# Altium project PCB_DYBoard_Collector_V1.PrjPcb
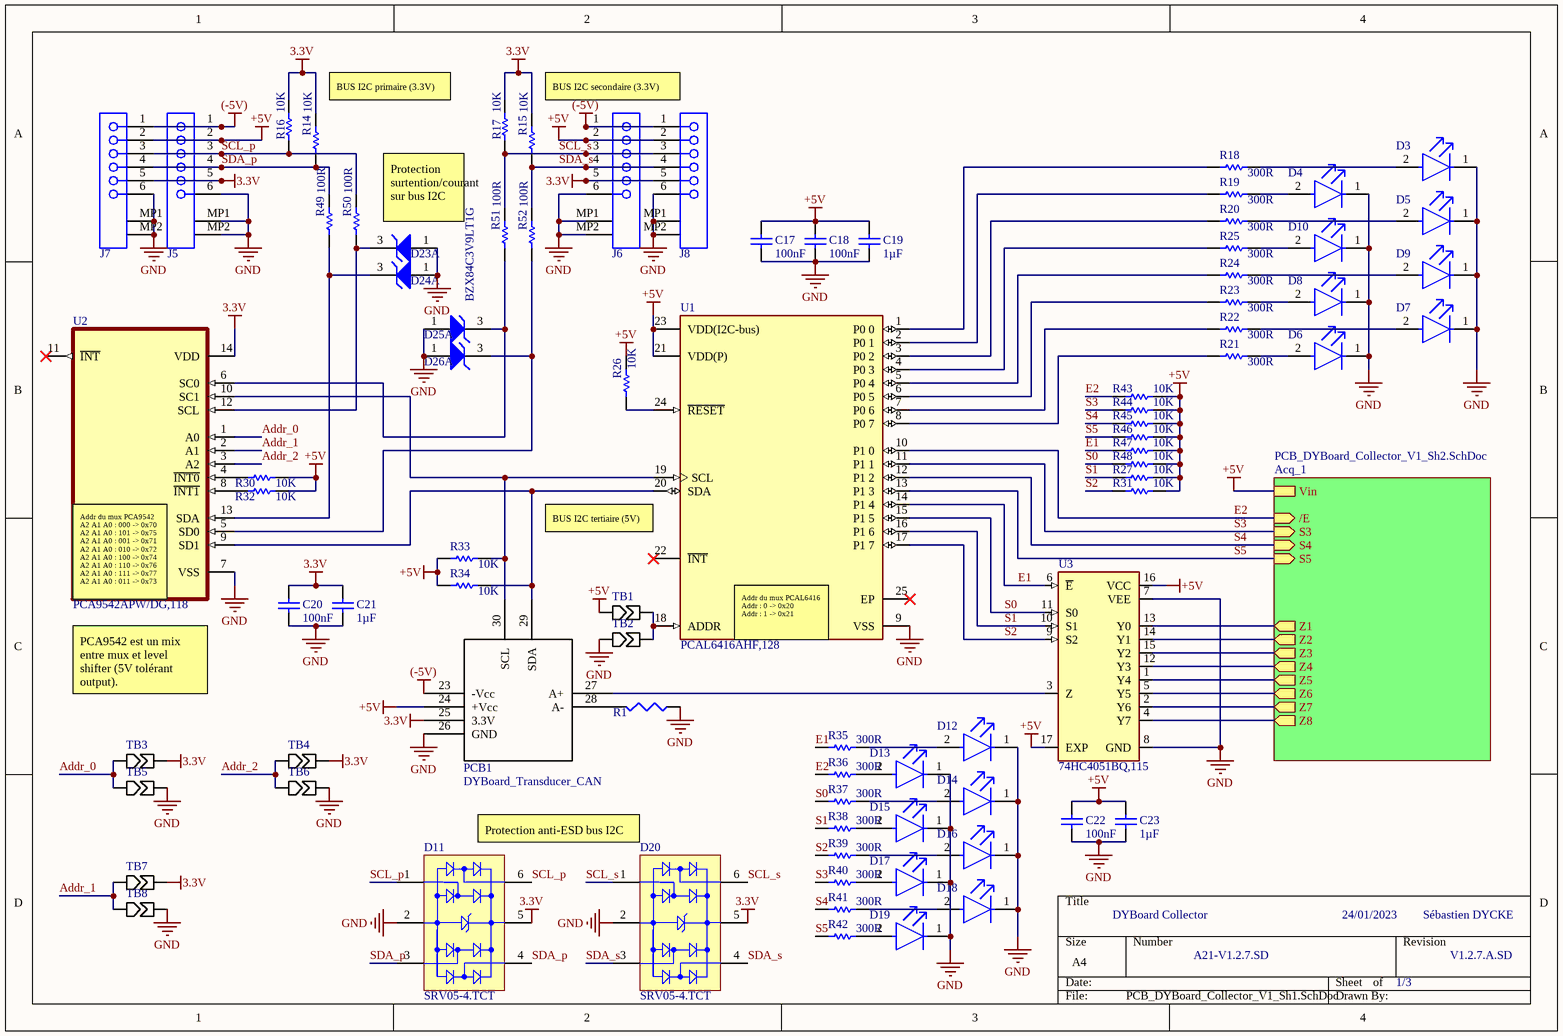
[diagram p0: PCB_DYBoard_Collector_V1_Sh1.SchDoc]
3 sheets, 309 parts. Net scope: hierarchical (ports join the sheet entries above them; power ports are global).
Board file: PCB_DYBoard_Collector_V1.PcbDoc
Sheets:
  PCB_DYBoard_Collector_V1_Sh1.SchDoc
    Acq_1 = PCB_DYBoard_Collector_V1_Sh2.SchDoc
      con_1 = PCB_DYBoard_Collector_V1_Sh3.SchDoc
      con_2 = PCB_DYBoard_Collector_V1_Sh3.SchDoc
      con_3 = PCB_DYBoard_Collector_V1_Sh3.SchDoc
      con_4 = PCB_DYBoard_Collector_V1_Sh3.SchDoc
      con_5 = PCB_DYBoard_Collector_V1_Sh3.SchDoc
      con_6 = PCB_DYBoard_Collector_V1_Sh3.SchDoc
      con_7 = PCB_DYBoard_Collector_V1_Sh3.SchDoc
      con_8 = PCB_DYBoard_Collector_V1_Sh3.SchDoc

## Sheet PCB_DYBoard_Collector_V1_Sh1.SchDoc
size A4; SheetNumber: 1; SheetTotal: 3

### Parts
C17  value 100nF  [1608[0603]]  (hidden comment: Cap Semi)
C18  value 100nF  [1608[0603]]  (hidden comment: Cap Semi)
C19  value 1µF  [1608[0603]]  (hidden comment: Cap Semi)
C20  value 100nF  [1608[0603]]  (hidden comment: Cap Semi)
C21  value 1µF  [1608[0603]]  (hidden comment: Cap Semi)
C22  value 100nF  [1608[0603]]  (hidden comment: Cap Semi)
C23  value 1µF  [1608[0603]]  (hidden comment: Cap Semi)
D3  LTST-C191TBKT  [FP-LTST-C191TBKT-MFG]  (value not drawn)
D4  LTST-C191TBKT  [FP-LTST-C191TBKT-MFG]  (value not drawn)
D5  LTST-C191TBKT  [FP-LTST-C191TBKT-MFG]  (value not drawn)
D6  LTST-C191TBKT  [FP-LTST-C191TBKT-MFG]  (value not drawn)
D7  LTST-C191TBKT  [FP-LTST-C191TBKT-MFG]  (value not drawn)
D8  LTST-C191TBKT  [FP-LTST-C191TBKT-MFG]  (value not drawn)
D9  LTST-C191TBKT  [FP-LTST-C191TBKT-MFG]  (value not drawn)
D10  LTST-C191TBKT  [FP-LTST-C191TBKT-MFG]  (value not drawn)
D11  SRV05-4.TCT  [SMTC-SOT23-6_V]
D12  LTST-C191TBKT  [FP-LTST-C191TBKT-MFG]  (value not drawn)
D13  LTST-C191TBKT  [FP-LTST-C191TBKT-MFG]  (value not drawn)
D14  LTST-C191TBKT  [FP-LTST-C191TBKT-MFG]  (value not drawn)
D15  LTST-C191TBKT  [FP-LTST-C191TBKT-MFG]  (value not drawn)
D16  LTST-C191TBKT  [FP-LTST-C191TBKT-MFG]  (value not drawn)
D17  LTST-C191TBKT  [FP-LTST-C191TBKT-MFG]  (value not drawn)
D18  LTST-C191TBKT  [FP-LTST-C191TBKT-MFG]  (value not drawn)
D19  LTST-C191TBKT  [FP-LTST-C191TBKT-MFG]  (value not drawn)
D20  SRV05-4.TCT  [SMTC-SOT23-6_V]
D23  BZX84C3V9LT1G  [ONSC-SOT-23-3-318-08_V]  (part A of 2)
D24  BZX84C3V9LT1G  [ONSC-SOT-23-3-318-08_V]  (value not drawn)  (part A of 2)
D25  BZX84C3V9LT1G  [ONSC-SOT-23-3-318-08_V]  (value not drawn)  (part A of 2)
D26  BZX84C3V9LT1G  [ONSC-SOT-23-3-318-08_V]  (value not drawn)  (part A of 2)
J5  SEB_MOLeX_6p  [SEB_MOLeX_6p]  (value not drawn)
J6  SEB_MOLeX_6p  [SEB_MOLeX_6p]  (value not drawn)
J7  SEB_MOLeX_6p  [SEB_MOLeX_6p]  (value not drawn)
J8  SEB_MOLeX_6p  [SEB_MOLeX_6p]  (value not drawn)
PCB1  DYBoard_Transducer_CAN  [DYBoard_Transducer_CAN]
R1  Res3  [J1-0603]  (value not drawn)
R14  10K  [RESC1609X60X30LL10T20]
R15  10K  [RESC1609X60X30LL10T20]
R16  10K  [RESC1609X60X30LL10T20]
R17  10K  [RESC1609X60X30LL10T20]
R18  300R  [RESC1609X60X30LL10T20]
R19  300R  [RESC1609X60X30LL10T20]
R20  300R  [RESC1609X60X30LL10T20]
R21  300R  [RESC1609X60X30LL10T20]
R22  300R  [RESC1609X60X30LL10T20]
R23  300R  [RESC1609X60X30LL10T20]
R24  300R  [RESC1609X60X30LL10T20]
R25  300R  [RESC1609X60X30LL10T20]
R26  10K  [RESC1609X60X30LL10T20]
R27  10K  [RESC1609X60X30LL10T20]
R30  10K  [RESC1609X60X30LL10T20]
R31  10K  [RESC1609X60X30LL10T20]
R32  10K  [RESC1609X60X30LL10T20]
R33  10K  [RESC1609X60X30LL10T20]
R34  10K  [RESC1609X60X30LL10T20]
R35  300R  [RESC1609X60X30LL10T20]
R36  300R  [RESC1609X60X30LL10T20]
R37  300R  [RESC1609X60X30LL10T20]
R38  300R  [RESC1609X60X30LL10T20]
R39  300R  [RESC1609X60X30LL10T20]
R40  300R  [RESC1609X60X30LL10T20]
R41  300R  [RESC1609X60X30LL10T20]
R42  300R  [RESC1609X60X30LL10T20]
R43  10K  [RESC1609X60X30LL10T20]
R44  10K  [RESC1609X60X30LL10T20]
R45  10K  [RESC1609X60X30LL10T20]
R46  10K  [RESC1609X60X30LL10T20]
R47  10K  [RESC1609X60X30LL10T20]
R48  10K  [RESC1609X60X30LL10T20]
R49  100R  [RESC1609X60X30LL10T20]
R50  100R  [RESC1609X60X30LL10T20]
R51  100R  [RESC1609X60X30LL10T20]
R52  100R  [RESC1609X60X30LL10T20]
TB1  tin_bridge  [tin_bridge]  (value not drawn)
TB2  tin_bridge  [tin_bridge]  (value not drawn)
TB3  tin_bridge  [tin_bridge]  (value not drawn)
TB4  tin_bridge  [tin_bridge]  (value not drawn)
TB5  tin_bridge  [tin_bridge]  (value not drawn)
TB6  tin_bridge  [tin_bridge]  (value not drawn)
TB7  tin_bridge  [tin_bridge]  (value not drawn)
TB8  tin_bridge  [tin_bridge]  (value not drawn)
U1  PCAL6416AHF,128  [FP-SOT994-1-MFG]
U2  PCA9542APW/DG,118  [SOP65P640X110-14N]
U3  74HC4051BQ,115  [QFN50P250X350X100-17N]

### Sub-sheets
Acq_1 = PCB_DYBoard_Collector_V1_Sh2.SchDoc: Vin, Z1 (out), S3 (in), S4 (in), S5 (in), /E (in), Z2 (out), Z3 (out), Z4 (out), Z5 (out), Z6 (out), Z7 (out), Z8 (out)

### Nets
3.3V: C20.2 C21.2 D11.5(VBUS) D20.5(VBUS) J5.5 J6.5 J7.5 J8.5 PCB1.25(3.3V) R14.2 R15.2 R16.2 R17.2 TB3.22 TB4.22 TB7.22 U2.14(VDD)
(-5V): J5.1 J6.1 J7.1 J8.1 PCB1.23(-Vcc)
+5V: C17.2 C18.2 C19.2 C22.2 C23.2 J5.2 J6.2 J7.2 J8.2 PCB1.24(+Vcc) R26.2 R27.1 R30.1 R31.1 R32.1 R33.2 R34.2 R43.1 R44.1 R45.1 R46.1 R47.1 R48.1 TB1.21 U1.21(VDD(P)) U1.23(VDD(I2C-bus)) U3.16(VCC) U3.17(EXP) ; sheet Acq_1/Vin
GND: C17.1 C18.1 C19.1 C20.1 C21.1 C22.1 C23.1 D3.1(C) D4.1(C) D5.1(C) D6.1(C) D7.1(C) D8.1(C) D9.1(C) D10.1(C) D11.2(GND) D12.1(C) D13.1(C) D14.1(C) D15.1(C) D16.1(C) D17.1(C) D18.1(C) D19.1(C) D20.2(GND) D23.1(A) D24.1(A) D25.1(A) D26.1(A) J5.6 J5.MP1 J5.MP2 J6.6 J6.MP1 J6.MP2 J7.6 J7.MP1 J7.MP2 J8.6 J8.MP1 J8.MP2 PCB1.26(GND) R1.2 TB2.21 TB5.22 TB6.22 TB8.22 U1.9(VSS) U2.7(VSS) U3.7(VEE) U3.8(GND)
Addr_0: TB3.21 TB5.21 U2.1(A0)
Addr_1: TB7.21 TB8.21 U2.2(A1)
Addr_2: TB4.21 TB6.21 U2.3(A2)
E1: R35.1 R47.2 U1.14(P1_4) U3.6(~{E})
E2: R36.1 R43.2 U1.10(P1_0) ; sheet Acq_1//E
S0: R37.1 R48.2 U1.15(P1_5) U3.11(S0)
S1: R27.2 R38.1 U1.16(P1_6) U3.10(S1)
S2: R31.2 R39.1 U1.17(P1_7) U3.9(S2)
S3: R40.1 R44.2 U1.11(P1_1) ; sheet Acq_1/S3
S4: R41.1 R45.2 U1.12(P1_2) ; sheet Acq_1/S4
S5: R42.1 R46.2 U1.13(P1_3) ; sheet Acq_1/S5
SCL_p: D11.1(I/O_1) D11.6(I/O_4) J5.3 J7.3 R16.1 R50.2
SCL_s: D20.1(I/O_1) D20.6(I/O_4) J6.3 J8.3 R17.1 R51.2
SDA_p: D11.3(I/O_2) D11.4(I/O_3) J5.4 J7.4 R14.1 R49.2
SDA_s: D20.3(I/O_2) D20.4(I/O_3) J6.4 J8.4 R15.1 R52.2
NetD3_2: D3.2(A) R18.2
NetD4_2: D4.2(A) R19.2
NetD5_2: D5.2(A) R20.2
NetD6_2: D6.2(A) R21.2
NetD7_2: D7.2(A) R22.2
NetD8_2: D8.2(A) R23.2
NetD9_2: D9.2(A) R24.2
NetD10_2: D10.2(A) R25.2
NetD12_2: D12.2(A) R35.2
NetD13_2: D13.2(A) R36.2
NetD14_2: D14.2(A) R37.2
NetD15_2: D15.2(A) R38.2
NetD16_2: D16.2(A) R39.2
NetD17_2: D17.2(A) R40.2
NetD18_2: D18.2(A) R41.2
NetD19_2: D19.2(A) R42.2
NetD23_3: D23.3(K) R50.1 U2.12(SCL)
NetD24_3: D24.3(K) R49.1 U2.13(SDA)
NetD25_3: D25.3(K) R51.1 U2.6(SC0)
NetD26_3: D26.3(K) R52.1 U2.5(SD0)
NetPCB1_27: PCB1.27(A+) U3.3(Z)
NetPCB1_28: PCB1.28(A-) R1.1
NetPCB1_29: PCB1.29(SDA) R34.1 U1.20(SDA) U2.9(SD1)
NetPCB1_30: PCB1.30(SCL) R33.1 U1.19(SCL) U2.10(SC1)
NetR18_1: R18.1 U1.1(P0_0)
NetR19_1: R19.1 U1.2(P0_1)
NetR20_1: R20.1 U1.3(P0_2)
NetR21_1: R21.1 U1.8(P0_7)
NetR22_1: R22.1 U1.7(P0_6)
NetR23_1: R23.1 U1.6(P0_5)
NetR24_1: R24.1 U1.5(P0_4)
NetR25_1: R25.1 U1.4(P0_3)
NetR26_1: R26.1 U1.24(~{RESET})
NetR30_2: R30.2 U2.4(~{INT0})
NetR32_2: R32.2 U2.8(~{INT1})
NetTB1_22: TB1.22 TB2.22 U1.18(ADDR)
NetU3_1: U3.1(Y4) ; sheet Acq_1/Z5
NetU3_2: U3.2(Y6) ; sheet Acq_1/Z7
NetU3_4: U3.4(Y7) ; sheet Acq_1/Z8
NetU3_5: U3.5(Y5) ; sheet Acq_1/Z6
NetU3_12: U3.12(Y3) ; sheet Acq_1/Z4
NetU3_13: U3.13(Y0) ; sheet Acq_1/Z1
NetU3_14: U3.14(Y1) ; sheet Acq_1/Z2
NetU3_15: U3.15(Y2) ; sheet Acq_1/Z3

Not connected (* = marked no-connect by the designer): U1 22(~{INT})* 25(EP)*; U2 11(~{INT})*

### Notes on the sheet
- BUS I2C primaire (3.3V)
- BUS I2C secondaire (3.3V)
- Protection surtention/courant sur bus I2C
- (near U1) BUS I2C tertiaire (5V)
- (near U2) Addr du mux PCA9542  A2 A1 A0 : 000 -> 0x70  A2 A1 A0 : 101 -> 0x75  A2 A1 A0 : 001 -> 0x71  A2 A1 A0 : 010 -> 0x72  A2 A1 A0 : 100 -> 0x74  A2 A1 A0 : 110 -> 0x76  A2 A1 A0 : 111 -> 0x77  A2 A1 A0 : 011 -> 0x73
- (near U1) Addr du mux PCAL6416  Addr : 0 -> 0x20                 Addr : 1 -> 0x21
- PCA9542 est un mix entre mux et level shifter (5V tolérant output).
- Protection anti-ESD bus I2C
- DYBoard Collector
- 24/01/2023
- Sébastien DYCKE
- A21-V1.2.7.SD
- 1/3
- V1.2.7.A.SD

### Library data of the parts
C17-C23 = Cap Semi: Capacitor (Semiconductor SIM Model); Published: 8-Jun-2000; LatestRevisionDate: 29-May-2009; LatestRevisionNote: IPC-7351 Footprint Added.; PackageReference: C1206; Publisher: Altium Limited; PackageDescription: Chip Capacitor
D3-D10 D12-D19 = CMP-22017-000008-1: LED BLUE CLEAR CHIP SMD; Lens Color: Colorless; Dominant Wavelength: 475nm; Forward Current: 20mA; Wavelength: 468nm; Viewing Angle: 130°; Power Dissipation: 76mW; Luminous Intensity: 180mcd; Reverse Voltage: 5V; Number of Elements: 1; Lens Style: Diffused; Forward Voltage: 3.8V; Max Power Dissipation: 75mW; Case Code (Metric): 1608; Packaging: Tape and Reel; Case/Package: 0603; Depth: 1.6mm; Mount: Surface Mount; Lead Free: Lead Free; Min Operating Temperature: -20°C; Lens Transparency: Clear; Illumination Color: Blue; Height: 0.55mm; Test Current: 20mA; Case Code (Imperial): 0603; Max Operating Temperature: 80°C; Number of Pins: 2; Length: 0.8mm; Radiation Hardening: No; Package Quantity: 1; Number of LEDs: 1; Width: 0.8mm; Color: Blue
D11 D20 = CMP-2000-05358-1: RailClamp(R) Low Capacitance TVS Diode Array, 5 pF, 17.5 VC, -55 to 125 degC, 6-Pin SOT23, RoHS, Tape and Reel; Manufacturer: Semtech; Leakage Current (Max): 5uA; Polarity: Uni-Directional; Peak Pulse Power Dissipation: 300W; Clamping Voltage: 17.5V; Number of Elements: 1; Working Voltage: 5V; Test Current (It): 1mA; Configuration: Quad; Reverse Breakdown Voltage: 6V; Suppressor Type: DiodeArrays; Peak Pulse Current: 12A; Product Depth (mm): 1.6mm; Product Height (mm): 1.15mm; Clamping Voltage (Max): 12.5V; Rad Hardened: No; Product Length (mm): 2.9mm; Capacitance Value: 5pF; Mounting: SurfaceMount; Datasheet URL: https://datasheet.ciiva.com/8029/srv05-4-8029973.pdf; Datasheet Version: Jan-08; Packaging: TapeandReel; Package / Case: SOT-23; Operating Temp Range: -55Cto125C; Pin Count: 6; Direction Type: Uni-Directional; Operating Temperature Min Deg. C: -55C; Reverse Stand-off Voltage: 5V; Leakage Current: 5uA; Manufacturer URL: http://www.semtech.com/; Working Voltage (Max): 5V; Package Reference: SOT23-6; Package Description: 6-Pin Small Outline Transistor, Body 2.9 x 1.6 mm, Pitch 0.95 mm; Operating Temperature Max Deg. C: 125C; Operating Temperature Classification: Military; Mounting Style: SurfaceMount
D23-D26 = CMP-1060-01129-1: Zener Voltage Regulator, 225 mW, 3-Pin SOT-23, Pb-Free, Tape and Reel; Manufacturer: On Semiconductor; ComponentLink3URL: http://www.onsemi.cn/pub_link/Collateral/318-08.PDF; PartNumber: BZX84C3V9LT1G; ComponentLink2URL: http://www.onsemi.com/pub_link/Collateral/BZX84C2V4LT1-D.PDF; PackageReference: SOT-23-3-318-08; DatasheetVersion: Rev. 17; ComponentLink3Description: Package Specification; ComponentLink1Description: Manufacturer URL; Packing: Tape and Reel; ComponentLink1URL: http://www.onsemi.com/; RoHS: Pb-Free; PackageVersion: Rev. AP, 11/2009; Mounting Technology: Surface Mount; PackageDescription: 3-Pin Small Outline Transistor, Body 2.92 x 1.3 mm, Pitch 0.95 mm; ComponentLink2Description: Datasheet
R1 = Res3: Resistor; Published: 8-Jun-2000; LatestRevisionDate: 29-May-2009; LatestRevisionNote: IPC-7351 Footprint Added.; PackageReference: J1-0603; Publisher: Altium Limited; PackageDescription: Chip Resistor
R14-R27 R30-R52 = CMP-2000-03671-1: Part Number: RCWE0603R560FKEA; Manufacturer: Vishay Dale
U1 = CMP-10112-000009-1: IC I/O EXPANDER 16BIT 24HWQFN; Manufacturer: NXP Semiconductors; Number Of I/Os: 16; Min Supply Voltage: 1.65V; Frequency: 400kHz; Standoff Height: 0mm; Max Junction Temp: +125°C; Max Supply Voltage: 5.5V; Nominal Supply Current: 1.1mA; Interface: I2C,SMBus; Digikey Description: IC I/O EXPANDER 16BIT 24HWQFN; Device Class L3: I/O Expanders; Automotive: No; Mouser Description: Interface - I/O Expanders 16-bit I2C-busSMBus Low Voltage; Ambient Temperature Range Low: -40°C; Category: IC; ComponentLink2URL: https://www.nxp.com/docs/en/data-sheet/PCAL6416A.pdf; Ambient Temperature Range High: +85°C; Height: 0.8mm; Device Class L1: Integrated Circuits (ICs); Package: SOT994-1; RoHS: TRUE; Temperature Range High: +85°C; Octopart: https://octopart.com/pcal6416ahf%2C128-nxp+semiconductors-24406122; Lead Free: Yes; ComponentLink2Description: Datasheet; Device Class L2: Interface ICs; Temperature Range Low: -40°C; Manufacturer Part Number: PCAL6416AHF,128; Temperature: -40°C to +85°C; Ipc Land Pattern Name: QFN50P400X400X80-24; Footprint Url: https://www.nxp.com/docs/en/package-information/SOT994-1.pdf
U2 = PCA9542APW/DG,118: 2-channel I2C-bus multiplexer and interrupt logic; Package: None; Price: None; Value: *; MP: PCA9542APW/DG,118; Availability: Unavailable
U3 = 74HC4051BQ,115: 1 Circuit IC Switch 8:1 120Ohm 16-DHVQFN _2.5x3.5_; MF: Nexperia USA; Value: *; SnapEDA_Link: https://www.snapeda.com/parts/74HC4051BQ%2C115/Nexperia%20USA%20Inc./view-part/523294/?ref=snap; Availability: Unavailable; MP: 74HC4051BQ,115; Package: DHVQFN-16 NXP Semiconductors; Price: None

## Sheet PCB_DYBoard_Collector_V1_Sh2.SchDoc
size A4; SheetNumber: 2; SheetTotal: 3
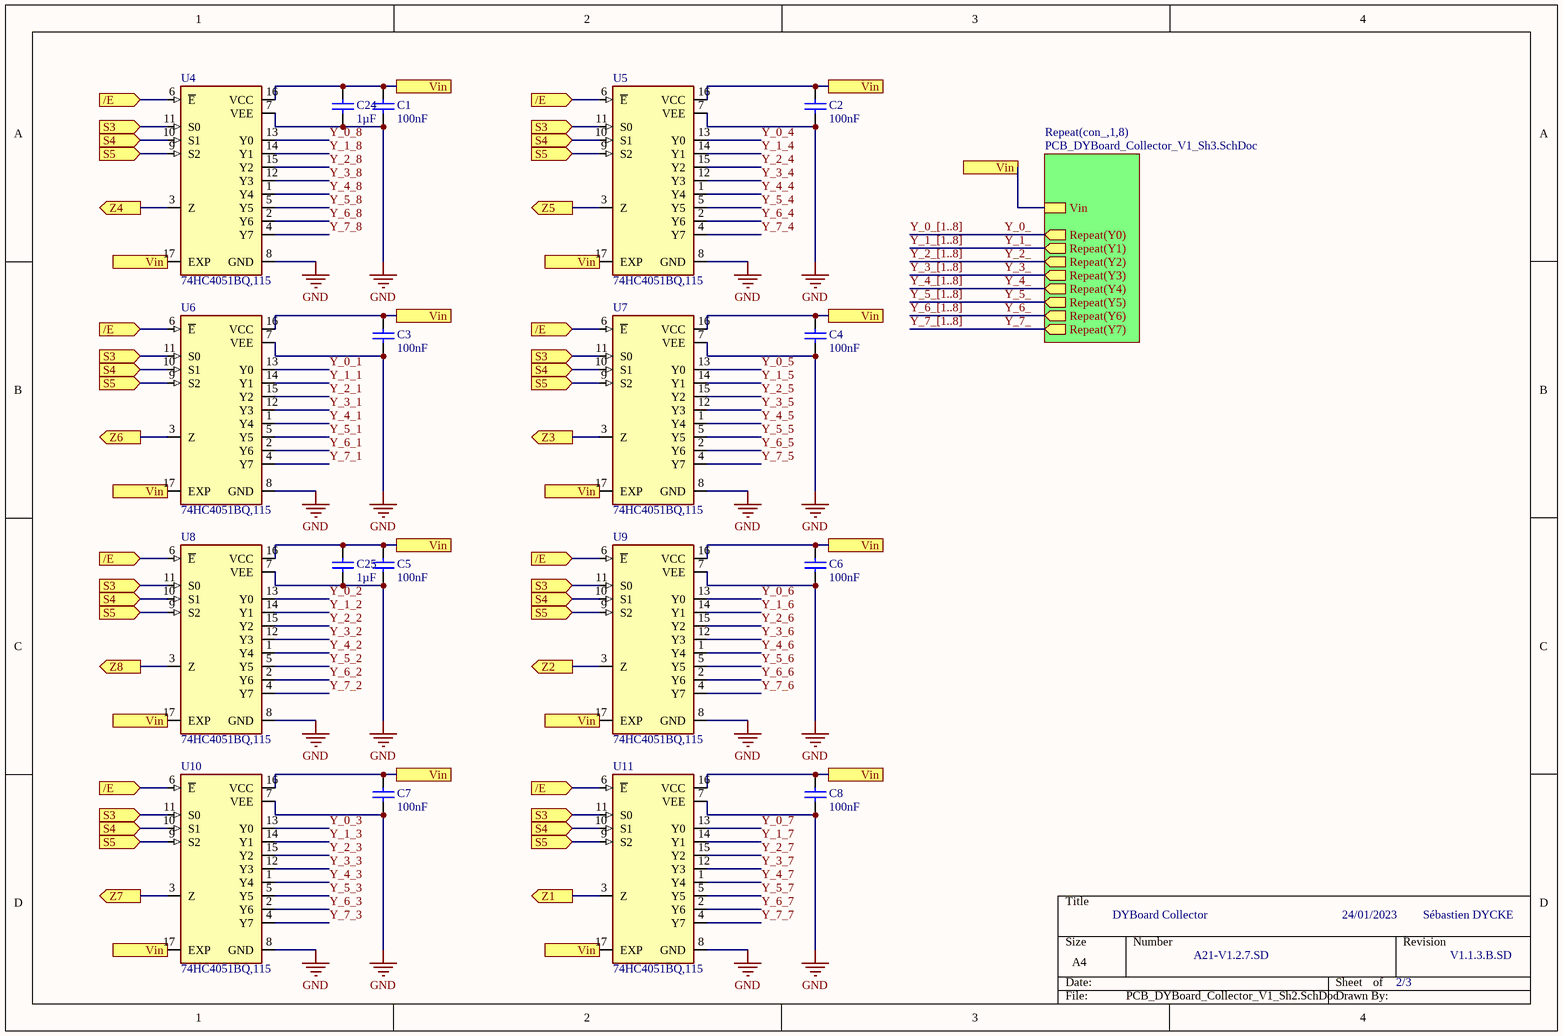
[diagram p1: PCB_DYBoard_Collector_V1_Sh2.SchDoc]

### Parts
C1  value 100nF  [1608[0603]]  (hidden comment: Cap Semi)
C2  value 100nF  [1608[0603]]  (hidden comment: Cap Semi)
C3  value 100nF  [1608[0603]]  (hidden comment: Cap Semi)
C4  value 100nF  [1608[0603]]  (hidden comment: Cap Semi)
C5  value 100nF  [1608[0603]]  (hidden comment: Cap Semi)
C6  value 100nF  [1608[0603]]  (hidden comment: Cap Semi)
C7  value 100nF  [1608[0603]]  (hidden comment: Cap Semi)
C8  value 100nF  [1608[0603]]  (hidden comment: Cap Semi)
C24  value 1µF  [1608[0603]]  (hidden comment: Cap Semi)
C25  value 1µF  [1608[0603]]  (hidden comment: Cap Semi)
U4  74HC4051BQ,115  [QFN50P250X350X100-17N]
U5  74HC4051BQ,115  [QFN50P250X350X100-17N]
U6  74HC4051BQ,115  [QFN50P250X350X100-17N]
U7  74HC4051BQ,115  [QFN50P250X350X100-17N]
U8  74HC4051BQ,115  [QFN50P250X350X100-17N]
U9  74HC4051BQ,115  [QFN50P250X350X100-17N]
U10  74HC4051BQ,115  [QFN50P250X350X100-17N]
U11  74HC4051BQ,115  [QFN50P250X350X100-17N]

### Sub-sheets
Repeat(con_,1,8) = PCB_DYBoard_Collector_V1_Sh3.SchDoc: Vin, Repeat(Y0) (out), Repeat(Y1) (out), Repeat(Y2) (out), Repeat(Y3) (out), Repeat(Y4) (out), Repeat(Y5) (out), Repeat(Y6) (out), Repeat(Y7) (out)

### Ports
/E (in, see PCB_DYBoard_Collector_V1_Sh1[4C]), S3 (in, see PCB_DYBoard_Collector_V1_Sh1[4C]), S4 (in, see PCB_DYBoard_Collector_V1_Sh1[4C]), S5 (in, see PCB_DYBoard_Collector_V1_Sh1[4C]), Vin (see PCB_DYBoard_Collector_V1_Sh1[4B], PCB_DYBoard_Collector_V1_Sh3[1C], PCB_DYBoard_Collector_V1_Sh3[2B], PCB_DYBoard_Collector_V1_Sh3[2C], PCB_DYBoard_Collector_V1_Sh3[3C], PCB_DYBoard_Collector_V1_Sh3[4B], PCB_DYBoard_Collector_V1_Sh3[4C]), Z1 (out, see PCB_DYBoard_Collector_V1_Sh1[4C]), Z2 (out, see PCB_DYBoard_Collector_V1_Sh1[4C]), Z3 (out, see PCB_DYBoard_Collector_V1_Sh1[4C]), Z4 (out, see PCB_DYBoard_Collector_V1_Sh1[4C]), Z5 (out, see PCB_DYBoard_Collector_V1_Sh1[4C]), Z6 (out, see PCB_DYBoard_Collector_V1_Sh1[4C]), Z7 (out, see PCB_DYBoard_Collector_V1_Sh1[4C]), Z8 (out, see PCB_DYBoard_Collector_V1_Sh1[4C])

### Nets
+5V: C1.2 C2.2 C3.2 C4.2 C5.2 C6.2 C7.2 C8.2 C24.2 C25.2 U4.16(VCC) U4.17(EXP) U5.16(VCC) U5.17(EXP) U6.16(VCC) U6.17(EXP) U7.16(VCC) U7.17(EXP) U8.16(VCC) U8.17(EXP) U9.16(VCC) U9.17(EXP) U10.16(VCC) U10.17(EXP) U11.16(VCC) U11.17(EXP) ; port Vin, sheet Repeat(con_,1,8)/Vin
GND: C1.1 C2.1 C3.1 C4.1 C5.1 C6.1 C7.1 C8.1 C24.1 C25.1 U4.7(VEE) U4.8(GND) U5.7(VEE) U5.8(GND) U6.7(VEE) U6.8(GND) U7.7(VEE) U7.8(GND) U8.7(VEE) U8.8(GND) U9.7(VEE) U9.8(GND) U10.7(VEE) U10.8(GND) U11.7(VEE) U11.8(GND)
E2: U4.6(~{E}) U5.6(~{E}) U6.6(~{E}) U7.6(~{E}) U8.6(~{E}) U9.6(~{E}) U10.6(~{E}) U11.6(~{E}) ; port /E
S3: U4.11(S0) U5.11(S0) U6.11(S0) U7.11(S0) U8.11(S0) U9.11(S0) U10.11(S0) U11.11(S0) ; port S3
S4: U4.10(S1) U5.10(S1) U6.10(S1) U7.10(S1) U8.10(S1) U9.10(S1) U10.10(S1) U11.10(S1) ; port S4
S5: U4.9(S2) U5.9(S2) U6.9(S2) U7.9(S2) U8.9(S2) U9.9(S2) U10.9(S2) U11.9(S2) ; port S5
Y_0_: sheet Repeat(con_,1,8)/Repeat(Y0)
Y_0_1: U6.13(Y0)
Y_0_2: U8.13(Y0)
Y_0_3: U10.13(Y0)
Y_0_4: U5.13(Y0)
Y_0_5: U7.13(Y0)
Y_0_6: U9.13(Y0)
Y_0_7: U11.13(Y0)
Y_0_8: U4.13(Y0)
Y_1_: sheet Repeat(con_,1,8)/Repeat(Y1)
Y_1_1: U6.14(Y1)
Y_1_2: U8.14(Y1)
Y_1_3: U10.14(Y1)
Y_1_4: U5.14(Y1)
Y_1_5: U7.14(Y1)
Y_1_6: U9.14(Y1)
Y_1_7: U11.14(Y1)
Y_1_8: U4.14(Y1)
Y_2_: sheet Repeat(con_,1,8)/Repeat(Y2)
Y_2_1: U6.15(Y2)
Y_2_2: U8.15(Y2)
Y_2_3: U10.15(Y2)
Y_2_4: U5.15(Y2)
Y_2_5: U7.15(Y2)
Y_2_6: U9.15(Y2)
Y_2_7: U11.15(Y2)
Y_2_8: U4.15(Y2)
Y_3_: sheet Repeat(con_,1,8)/Repeat(Y3)
Y_3_1: U6.12(Y3)
Y_3_2: U8.12(Y3)
Y_3_3: U10.12(Y3)
Y_3_4: U5.12(Y3)
Y_3_5: U7.12(Y3)
Y_3_6: U9.12(Y3)
Y_3_7: U11.12(Y3)
Y_3_8: U4.12(Y3)
Y_4_: sheet Repeat(con_,1,8)/Repeat(Y4)
Y_4_1: U6.1(Y4)
Y_4_2: U8.1(Y4)
Y_4_3: U10.1(Y4)
Y_4_4: U5.1(Y4)
Y_4_5: U7.1(Y4)
Y_4_6: U9.1(Y4)
Y_4_7: U11.1(Y4)
Y_4_8: U4.1(Y4)
Y_5_: sheet Repeat(con_,1,8)/Repeat(Y5)
Y_5_1: U6.5(Y5)
Y_5_2: U8.5(Y5)
Y_5_3: U10.5(Y5)
Y_5_4: U5.5(Y5)
Y_5_5: U7.5(Y5)
Y_5_6: U9.5(Y5)
Y_5_7: U11.5(Y5)
Y_5_8: U4.5(Y5)
Y_6_: sheet Repeat(con_,1,8)/Repeat(Y6)
Y_6_1: U6.2(Y6)
Y_6_2: U8.2(Y6)
Y_6_3: U10.2(Y6)
Y_6_4: U5.2(Y6)
Y_6_5: U7.2(Y6)
Y_6_6: U9.2(Y6)
Y_6_7: U11.2(Y6)
Y_6_8: U4.2(Y6)
Y_7_: sheet Repeat(con_,1,8)/Repeat(Y7)
Y_7_1: U6.4(Y7)
Y_7_2: U8.4(Y7)
Y_7_3: U10.4(Y7)
Y_7_4: U5.4(Y7)
Y_7_5: U7.4(Y7)
Y_7_6: U9.4(Y7)
Y_7_7: U11.4(Y7)
Y_7_8: U4.4(Y7)
NetU3_1: U5.3(Z) ; port Z5
NetU3_2: U10.3(Z) ; port Z7
NetU3_4: U8.3(Z) ; port Z8
NetU3_5: U6.3(Z) ; port Z6
NetU3_12: U4.3(Z) ; port Z4
NetU3_13: U11.3(Z) ; port Z1
NetU3_14: U9.3(Z) ; port Z2
NetU3_15: U7.3(Z) ; port Z3

### Buses and harness runs
bus Y_0_[1..8]
bus Y_1_[1..8]
bus Y_2_[1..8]
bus Y_3_[1..8]
bus Y_4_[1..8]
bus Y_5_[1..8]
bus Y_6_[1..8]
bus Y_7_[1..8]

### Notes on the sheet
- DYBoard Collector
- 24/01/2023
- Sébastien DYCKE
- A21-V1.2.7.SD
- 2/3
- V1.1.3.B.SD

### Library data of the parts
C1-C8 C24 C25 = Cap Semi: Capacitor (Semiconductor SIM Model); Published: 8-Jun-2000; LatestRevisionDate: 29-May-2009; LatestRevisionNote: IPC-7351 Footprint Added.; PackageReference: C1206; Publisher: Altium Limited; PackageDescription: Chip Capacitor
U4-U11 = 74HC4051BQ,115: as U3 on sheet PCB_DYBoard_Collector_V1_Sh1; Value: *; SnapEDA_Link: https://www.snapeda.com/parts/74HC4051BQ%2C115/Nexperia%20USA%20Inc./view-part/523294/?ref=snap; Availability: Unavailable; MP: 74HC4051BQ,115; Package: DHVQFN-16 NXP Semiconductors; Price: None

## Sheet PCB_DYBoard_Collector_V1_Sh3.SchDoc
size A4; SheetNumber: 3; SheetTotal: 3
Used 8 times, as channels Acq_1/con_1, Acq_1/con_2, Acq_1/con_3, Acq_1/con_4, Acq_1/con_5, Acq_1/con_6, Acq_1/con_7, Acq_1/con_8. Parts and nets are listed once, with the designators drawn on the sheet.
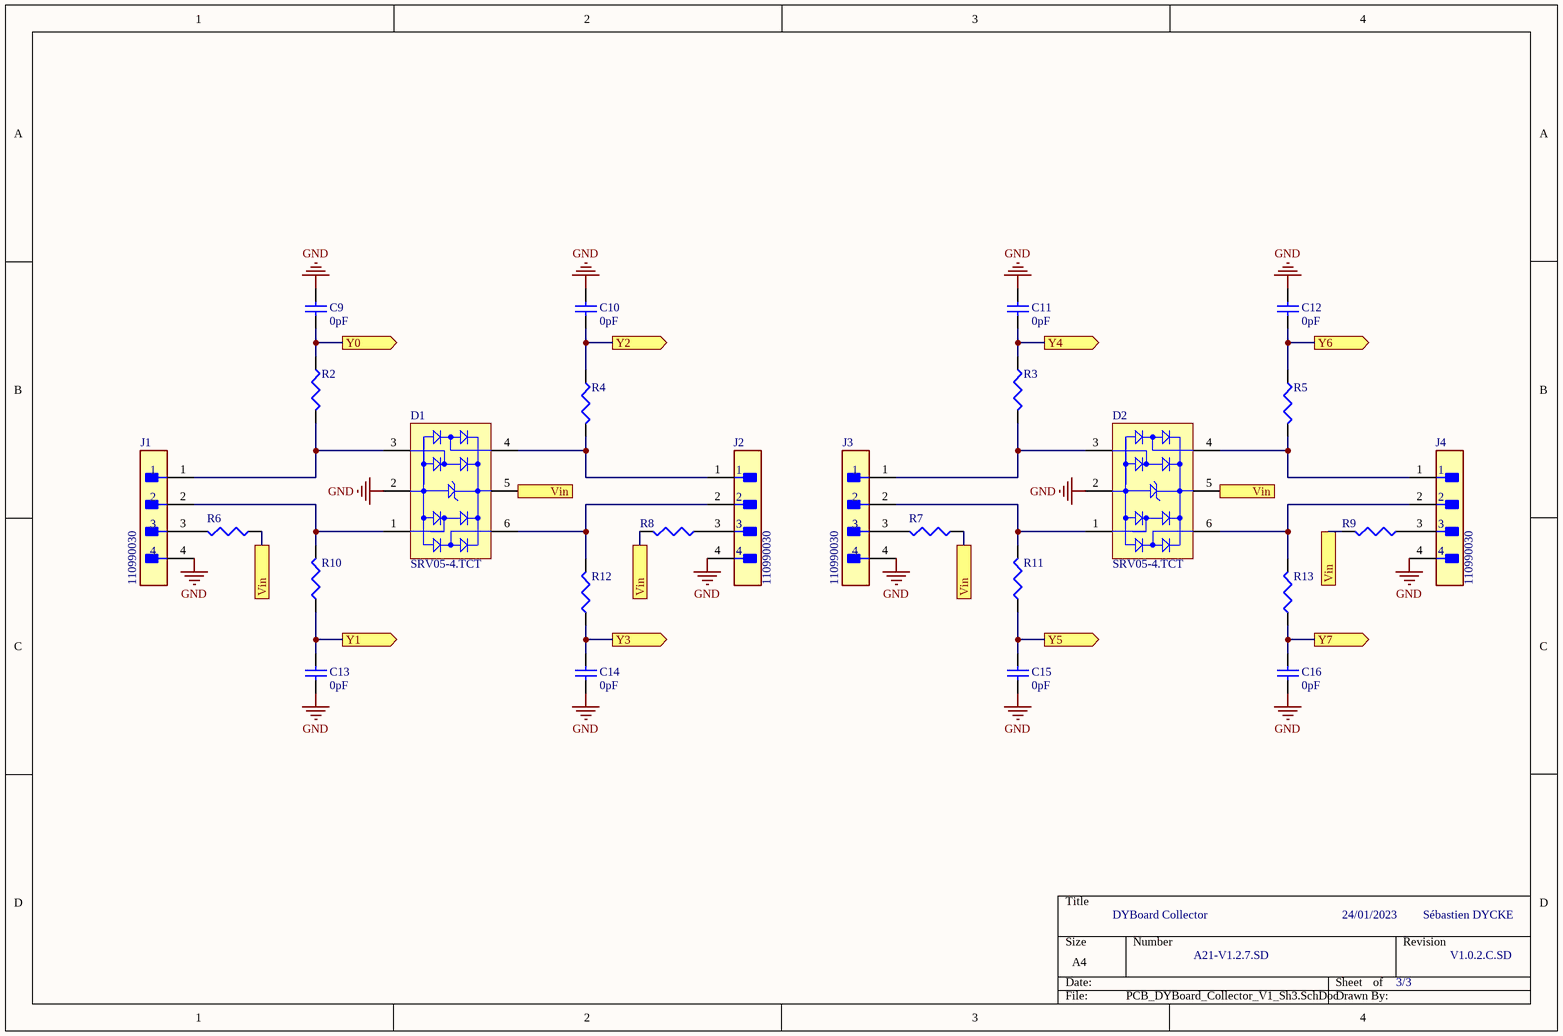
[diagram p2: PCB_DYBoard_Collector_V1_Sh3.SchDoc]

### Parts
C9  value 0pF  [1608[0603]]  (hidden comment: Cap Semi)
C10  value 0pF  [1608[0603]]  (hidden comment: Cap Semi)
C11  value 0pF  [1608[0603]]  (hidden comment: Cap Semi)
C12  value 0pF  [1608[0603]]  (hidden comment: Cap Semi)
C13  value 0pF  [1608[0603]]  (hidden comment: Cap Semi)
C14  value 0pF  [1608[0603]]  (hidden comment: Cap Semi)
C15  value 0pF  [1608[0603]]  (hidden comment: Cap Semi)
C16  value 0pF  [1608[0603]]  (hidden comment: Cap Semi)
D1  SRV05-4.TCT  [SMTC-SOT23-6_V]
D2  SRV05-4.TCT  [SMTC-SOT23-6_V]
J1  110990030  [FP-110990030-MFG]
J2  110990030  [FP-110990030-MFG]
J3  110990030  [FP-110990030-MFG]
J4  110990030  [FP-110990030-MFG]
R2  Res3  [J1-0603]  (value not drawn)
R3  Res3  [J1-0603]  (value not drawn)
R4  Res3  [J1-0603]  (value not drawn)
R5  Res3  [J1-0603]  (value not drawn)
R6  Res3  [J1-0603]  (value not drawn)
R7  Res3  [J1-0603]  (value not drawn)
R8  Res3  [J1-0603]  (value not drawn)
R9  Res3  [J1-0603]  (value not drawn)
R10  Res3  [J1-0603]  (value not drawn)
R11  Res3  [J1-0603]  (value not drawn)
R12  Res3  [J1-0603]  (value not drawn)
R13  Res3  [J1-0603]  (value not drawn)

### Ports
Vin (see PCB_DYBoard_Collector_V1_Sh2[3A], PCB_DYBoard_Collector_V1_Sh2[1B], PCB_DYBoard_Collector_V1_Sh2[1C], PCB_DYBoard_Collector_V1_Sh2[1D], PCB_DYBoard_Collector_V1_Sh2[2A], PCB_DYBoard_Collector_V1_Sh2[2B], PCB_DYBoard_Collector_V1_Sh2[2C], PCB_DYBoard_Collector_V1_Sh2[2D], PCB_DYBoard_Collector_V1_Sh2[3A], PCB_DYBoard_Collector_V1_Sh2[3B], PCB_DYBoard_Collector_V1_Sh2[3C], PCB_DYBoard_Collector_V1_Sh2[3D]), Y0 (out, see PCB_DYBoard_Collector_V1_Sh2[3A]), Y1 (out, see PCB_DYBoard_Collector_V1_Sh2[3A]), Y2 (out, see PCB_DYBoard_Collector_V1_Sh2[3B]), Y3 (out, see PCB_DYBoard_Collector_V1_Sh2[3B]), Y4 (out, see PCB_DYBoard_Collector_V1_Sh2[3B]), Y5 (out, see PCB_DYBoard_Collector_V1_Sh2[3B]), Y6 (out, see PCB_DYBoard_Collector_V1_Sh2[3B]), Y7 (out, see PCB_DYBoard_Collector_V1_Sh2[3B])

### Nets
GND: C9.2 C10.2 C11.2 C12.2 C13.1 C14.1 C15.1 C16.1 D1.2(GND) D2.2(GND) J1.4 J2.4 J3.4 J4.4
Vin: D1.5(VBUS) D2.5(VBUS) R6.2 R7.2 R8.2 R9.2 ; port Vin
Y0: C9.1 R2.1 ; port Y0
Y1: C13.2 R10.1 ; port Y1
Y2: C10.1 R4.1 ; port Y2
Y3: C14.2 R12.1 ; port Y3
Y4: C11.1 R3.1 ; port Y4
Y5: C15.2 R11.1 ; port Y5
Y6: C12.1 R5.1 ; port Y6
Y7: C16.2 R13.1 ; port Y7
NetD1_1: D1.1(I/O_1) J1.2 R10.2
NetD1_3: D1.3(I/O_2) J1.1 R2.2
NetD1_4: D1.4(I/O_3) J2.1 R4.2
NetD1_6: D1.6(I/O_4) J2.2 R12.2
NetD2_1: D2.1(I/O_1) J3.2 R11.2
NetD2_3: D2.3(I/O_2) J3.1 R3.2
NetD2_4: D2.4(I/O_3) J4.1 R5.2
NetD2_6: D2.6(I/O_4) J4.2 R13.2
NetJ1_3: J1.3 R6.1
NetJ2_3: J2.3 R8.1
NetJ3_3: J3.3 R7.1
NetJ4_3: J4.3 R9.1

### Channels
Acq_1/con_1: designators end in _con_1; ports Vin=+5V Y0=Y_0_1 Y1=Y_1_1 Y2=Y_2_1 Y3=Y_3_1 Y4=Y_4_1 Y5=Y_5_1 Y6=Y_6_1 Y7=Y_7_1
Acq_1/con_2: designators end in _con_2; ports Vin=+5V Y0=Y_0_2 Y1=Y_1_2 Y2=Y_2_2 Y3=Y_3_2 Y4=Y_4_2 Y5=Y_5_2 Y6=Y_6_2 Y7=Y_7_2
Acq_1/con_3: designators end in _con_3; ports Vin=+5V Y0=Y_0_3 Y1=Y_1_3 Y2=Y_2_3 Y3=Y_3_3 Y4=Y_4_3 Y5=Y_5_3 Y6=Y_6_3 Y7=Y_7_3
Acq_1/con_4: designators end in _con_4; ports Vin=+5V Y0=Y_0_4 Y1=Y_1_4 Y2=Y_2_4 Y3=Y_3_4 Y4=Y_4_4 Y5=Y_5_4 Y6=Y_6_4 Y7=Y_7_4
Acq_1/con_5: designators end in _con_5; ports Vin=+5V Y0=Y_0_5 Y1=Y_1_5 Y2=Y_2_5 Y3=Y_3_5 Y4=Y_4_5 Y5=Y_5_5 Y6=Y_6_5 Y7=Y_7_5
Acq_1/con_6: designators end in _con_6; ports Vin=+5V Y0=Y_0_6 Y1=Y_1_6 Y2=Y_2_6 Y3=Y_3_6 Y4=Y_4_6 Y5=Y_5_6 Y6=Y_6_6 Y7=Y_7_6
Acq_1/con_7: designators end in _con_7; ports Vin=+5V Y0=Y_0_7 Y1=Y_1_7 Y2=Y_2_7 Y3=Y_3_7 Y4=Y_4_7 Y5=Y_5_7 Y6=Y_6_7 Y7=Y_7_7
Acq_1/con_8: designators end in _con_8; ports Vin=+5V Y0=Y_0_8 Y1=Y_1_8 Y2=Y_2_8 Y3=Y_3_8 Y4=Y_4_8 Y5=Y_5_8 Y6=Y_6_8 Y7=Y_7_8

### Notes on the sheet
- DYBoard Collector
- 24/01/2023
- Sébastien DYCKE
- A21-V1.2.7.SD
- 3/3
- V1.0.2.C.SD

### Library data of the parts
C9-C16 = Cap Semi: Capacitor (Semiconductor SIM Model); Published: 8-Jun-2000; LatestRevisionDate: 29-May-2009; LatestRevisionNote: IPC-7351 Footprint Added.; PackageReference: C1206; Publisher: Altium Limited; PackageDescription: Chip Capacitor
D1 D2 = CMP-2000-05358-1: as D11 on sheet PCB_DYBoard_Collector_V1_Sh1; Mounting: SurfaceMount; Datasheet URL: https://datasheet.ciiva.com/8029/srv05-4-8029973.pdf; Datasheet Version: Jan-08; Packaging: TapeandReel; Package / Case: SOT-23; Operating Temp Range: -55Cto125C; Pin Count: 6; Direction Type: Uni-Directional; Operating Temperature Min Deg. C: -55C; Reverse Stand-off Voltage: 5V; Leakage Current: 5uA; Manufacturer URL: http://www.semtech.com/; Working Voltage (Max): 5V; Package Reference: SOT23-6; Package Description: 6-Pin Small Outline Transistor, Body 2.9 x 1.6 mm, Pitch 0.95 mm; Operating Temperature Max Deg. C: 125C; Operating Temperature Classification: Military; Mounting Style: SurfaceMount
J1-J4 = CMP-139044-000001-1: GROVE 2MM 4PIN VERT CONN 10PCS; Series: -
R2-R13 = Res3: Resistor; Published: 8-Jun-2000; LatestRevisionDate: 29-May-2009; LatestRevisionNote: IPC-7351 Footprint Added.; PackageReference: J1-0603; Publisher: Altium Limited; PackageDescription: Chip Resistor

## Nets that join several sheets
+5V: PCB_DYBoard_Collector_V1_Sh1 (28 pins), PCB_DYBoard_Collector_V1_Sh2 (26 pins), Acq_1/con_1 (6 pins), Acq_1/con_2 (6 pins), Acq_1/con_3 (6 pins), Acq_1/con_4 (6 pins), Acq_1/con_5 (6 pins), Acq_1/con_6 (6 pins), Acq_1/con_7 (6 pins), Acq_1/con_8 (6 pins)
GND: PCB_DYBoard_Collector_V1_Sh1 (51 pins), PCB_DYBoard_Collector_V1_Sh2 (26 pins), Acq_1/con_1 (14 pins), Acq_1/con_2 (14 pins), Acq_1/con_3 (14 pins), Acq_1/con_4 (14 pins), Acq_1/con_5 (14 pins), Acq_1/con_6 (14 pins), Acq_1/con_7 (14 pins), Acq_1/con_8 (14 pins)
E2: PCB_DYBoard_Collector_V1_Sh1 (R36.1 R43.2 U1.10), PCB_DYBoard_Collector_V1_Sh2 (8 pins)
NetU3_1: PCB_DYBoard_Collector_V1_Sh1 (U3.1), PCB_DYBoard_Collector_V1_Sh2 (U5.3)
NetU3_2: PCB_DYBoard_Collector_V1_Sh1 (U3.2), PCB_DYBoard_Collector_V1_Sh2 (U10.3)
NetU3_4: PCB_DYBoard_Collector_V1_Sh1 (U3.4), PCB_DYBoard_Collector_V1_Sh2 (U8.3)
NetU3_5: PCB_DYBoard_Collector_V1_Sh1 (U3.5), PCB_DYBoard_Collector_V1_Sh2 (U6.3)
NetU3_12: PCB_DYBoard_Collector_V1_Sh1 (U3.12), PCB_DYBoard_Collector_V1_Sh2 (U4.3)
NetU3_13: PCB_DYBoard_Collector_V1_Sh1 (U3.13), PCB_DYBoard_Collector_V1_Sh2 (U11.3)
NetU3_14: PCB_DYBoard_Collector_V1_Sh1 (U3.14), PCB_DYBoard_Collector_V1_Sh2 (U9.3)
NetU3_15: PCB_DYBoard_Collector_V1_Sh1 (U3.15), PCB_DYBoard_Collector_V1_Sh2 (U7.3)
S3: PCB_DYBoard_Collector_V1_Sh1 (R40.1 R44.2 U1.11), PCB_DYBoard_Collector_V1_Sh2 (8 pins)
S4: PCB_DYBoard_Collector_V1_Sh1 (R41.1 R45.2 U1.12), PCB_DYBoard_Collector_V1_Sh2 (8 pins)
S5: PCB_DYBoard_Collector_V1_Sh1 (R42.1 R46.2 U1.13), PCB_DYBoard_Collector_V1_Sh2 (8 pins)
Y_0_1: PCB_DYBoard_Collector_V1_Sh2 (U6.13), Acq_1/con_1 (C9_con_1.1 R2_con_1.1)
Y_0_2: PCB_DYBoard_Collector_V1_Sh2 (U8.13), Acq_1/con_2 (C9_con_2.1 R2_con_2.1)
Y_0_3: PCB_DYBoard_Collector_V1_Sh2 (U10.13), Acq_1/con_3 (C9_con_3.1 R2_con_3.1)
Y_0_4: PCB_DYBoard_Collector_V1_Sh2 (U5.13), Acq_1/con_4 (C9_con_4.1 R2_con_4.1)
Y_0_5: PCB_DYBoard_Collector_V1_Sh2 (U7.13), Acq_1/con_5 (C9_con_5.1 R2_con_5.1)
Y_0_6: PCB_DYBoard_Collector_V1_Sh2 (U9.13), Acq_1/con_6 (C9_con_6.1 R2_con_6.1)
Y_0_7: PCB_DYBoard_Collector_V1_Sh2 (U11.13), Acq_1/con_7 (C9_con_7.1 R2_con_7.1)
Y_0_8: PCB_DYBoard_Collector_V1_Sh2 (U4.13), Acq_1/con_8 (C9_con_8.1 R2_con_8.1)
Y_1_1: PCB_DYBoard_Collector_V1_Sh2 (U6.14), Acq_1/con_1 (C13_con_1.2 R10_con_1.1)
Y_1_2: PCB_DYBoard_Collector_V1_Sh2 (U8.14), Acq_1/con_2 (C13_con_2.2 R10_con_2.1)
Y_1_3: PCB_DYBoard_Collector_V1_Sh2 (U10.14), Acq_1/con_3 (C13_con_3.2 R10_con_3.1)
Y_1_4: PCB_DYBoard_Collector_V1_Sh2 (U5.14), Acq_1/con_4 (C13_con_4.2 R10_con_4.1)
Y_1_5: PCB_DYBoard_Collector_V1_Sh2 (U7.14), Acq_1/con_5 (C13_con_5.2 R10_con_5.1)
Y_1_6: PCB_DYBoard_Collector_V1_Sh2 (U9.14), Acq_1/con_6 (C13_con_6.2 R10_con_6.1)
Y_1_7: PCB_DYBoard_Collector_V1_Sh2 (U11.14), Acq_1/con_7 (C13_con_7.2 R10_con_7.1)
Y_1_8: PCB_DYBoard_Collector_V1_Sh2 (U4.14), Acq_1/con_8 (C13_con_8.2 R10_con_8.1)
Y_2_1: PCB_DYBoard_Collector_V1_Sh2 (U6.15), Acq_1/con_1 (C10_con_1.1 R4_con_1.1)
Y_2_2: PCB_DYBoard_Collector_V1_Sh2 (U8.15), Acq_1/con_2 (C10_con_2.1 R4_con_2.1)
Y_2_3: PCB_DYBoard_Collector_V1_Sh2 (U10.15), Acq_1/con_3 (C10_con_3.1 R4_con_3.1)
Y_2_4: PCB_DYBoard_Collector_V1_Sh2 (U5.15), Acq_1/con_4 (C10_con_4.1 R4_con_4.1)
Y_2_5: PCB_DYBoard_Collector_V1_Sh2 (U7.15), Acq_1/con_5 (C10_con_5.1 R4_con_5.1)
Y_2_6: PCB_DYBoard_Collector_V1_Sh2 (U9.15), Acq_1/con_6 (C10_con_6.1 R4_con_6.1)
Y_2_7: PCB_DYBoard_Collector_V1_Sh2 (U11.15), Acq_1/con_7 (C10_con_7.1 R4_con_7.1)
Y_2_8: PCB_DYBoard_Collector_V1_Sh2 (U4.15), Acq_1/con_8 (C10_con_8.1 R4_con_8.1)
Y_3_1: PCB_DYBoard_Collector_V1_Sh2 (U6.12), Acq_1/con_1 (C14_con_1.2 R12_con_1.1)
Y_3_2: PCB_DYBoard_Collector_V1_Sh2 (U8.12), Acq_1/con_2 (C14_con_2.2 R12_con_2.1)
Y_3_3: PCB_DYBoard_Collector_V1_Sh2 (U10.12), Acq_1/con_3 (C14_con_3.2 R12_con_3.1)
Y_3_4: PCB_DYBoard_Collector_V1_Sh2 (U5.12), Acq_1/con_4 (C14_con_4.2 R12_con_4.1)
Y_3_5: PCB_DYBoard_Collector_V1_Sh2 (U7.12), Acq_1/con_5 (C14_con_5.2 R12_con_5.1)
Y_3_6: PCB_DYBoard_Collector_V1_Sh2 (U9.12), Acq_1/con_6 (C14_con_6.2 R12_con_6.1)
Y_3_7: PCB_DYBoard_Collector_V1_Sh2 (U11.12), Acq_1/con_7 (C14_con_7.2 R12_con_7.1)
Y_3_8: PCB_DYBoard_Collector_V1_Sh2 (U4.12), Acq_1/con_8 (C14_con_8.2 R12_con_8.1)
Y_4_1: PCB_DYBoard_Collector_V1_Sh2 (U6.1), Acq_1/con_1 (C11_con_1.1 R3_con_1.1)
Y_4_2: PCB_DYBoard_Collector_V1_Sh2 (U8.1), Acq_1/con_2 (C11_con_2.1 R3_con_2.1)
Y_4_3: PCB_DYBoard_Collector_V1_Sh2 (U10.1), Acq_1/con_3 (C11_con_3.1 R3_con_3.1)
Y_4_4: PCB_DYBoard_Collector_V1_Sh2 (U5.1), Acq_1/con_4 (C11_con_4.1 R3_con_4.1)
Y_4_5: PCB_DYBoard_Collector_V1_Sh2 (U7.1), Acq_1/con_5 (C11_con_5.1 R3_con_5.1)
Y_4_6: PCB_DYBoard_Collector_V1_Sh2 (U9.1), Acq_1/con_6 (C11_con_6.1 R3_con_6.1)
Y_4_7: PCB_DYBoard_Collector_V1_Sh2 (U11.1), Acq_1/con_7 (C11_con_7.1 R3_con_7.1)
Y_4_8: PCB_DYBoard_Collector_V1_Sh2 (U4.1), Acq_1/con_8 (C11_con_8.1 R3_con_8.1)
Y_5_1: PCB_DYBoard_Collector_V1_Sh2 (U6.5), Acq_1/con_1 (C15_con_1.2 R11_con_1.1)
Y_5_2: PCB_DYBoard_Collector_V1_Sh2 (U8.5), Acq_1/con_2 (C15_con_2.2 R11_con_2.1)
Y_5_3: PCB_DYBoard_Collector_V1_Sh2 (U10.5), Acq_1/con_3 (C15_con_3.2 R11_con_3.1)
Y_5_4: PCB_DYBoard_Collector_V1_Sh2 (U5.5), Acq_1/con_4 (C15_con_4.2 R11_con_4.1)
Y_5_5: PCB_DYBoard_Collector_V1_Sh2 (U7.5), Acq_1/con_5 (C15_con_5.2 R11_con_5.1)
Y_5_6: PCB_DYBoard_Collector_V1_Sh2 (U9.5), Acq_1/con_6 (C15_con_6.2 R11_con_6.1)
Y_5_7: PCB_DYBoard_Collector_V1_Sh2 (U11.5), Acq_1/con_7 (C15_con_7.2 R11_con_7.1)
Y_5_8: PCB_DYBoard_Collector_V1_Sh2 (U4.5), Acq_1/con_8 (C15_con_8.2 R11_con_8.1)
Y_6_1: PCB_DYBoard_Collector_V1_Sh2 (U6.2), Acq_1/con_1 (C12_con_1.1 R5_con_1.1)
Y_6_2: PCB_DYBoard_Collector_V1_Sh2 (U8.2), Acq_1/con_2 (C12_con_2.1 R5_con_2.1)
Y_6_3: PCB_DYBoard_Collector_V1_Sh2 (U10.2), Acq_1/con_3 (C12_con_3.1 R5_con_3.1)
Y_6_4: PCB_DYBoard_Collector_V1_Sh2 (U5.2), Acq_1/con_4 (C12_con_4.1 R5_con_4.1)
Y_6_5: PCB_DYBoard_Collector_V1_Sh2 (U7.2), Acq_1/con_5 (C12_con_5.1 R5_con_5.1)
Y_6_6: PCB_DYBoard_Collector_V1_Sh2 (U9.2), Acq_1/con_6 (C12_con_6.1 R5_con_6.1)
Y_6_7: PCB_DYBoard_Collector_V1_Sh2 (U11.2), Acq_1/con_7 (C12_con_7.1 R5_con_7.1)
Y_6_8: PCB_DYBoard_Collector_V1_Sh2 (U4.2), Acq_1/con_8 (C12_con_8.1 R5_con_8.1)
Y_7_1: PCB_DYBoard_Collector_V1_Sh2 (U6.4), Acq_1/con_1 (C16_con_1.2 R13_con_1.1)
Y_7_2: PCB_DYBoard_Collector_V1_Sh2 (U8.4), Acq_1/con_2 (C16_con_2.2 R13_con_2.1)
Y_7_3: PCB_DYBoard_Collector_V1_Sh2 (U10.4), Acq_1/con_3 (C16_con_3.2 R13_con_3.1)
Y_7_4: PCB_DYBoard_Collector_V1_Sh2 (U5.4), Acq_1/con_4 (C16_con_4.2 R13_con_4.1)
Y_7_5: PCB_DYBoard_Collector_V1_Sh2 (U7.4), Acq_1/con_5 (C16_con_5.2 R13_con_5.1)
Y_7_6: PCB_DYBoard_Collector_V1_Sh2 (U9.4), Acq_1/con_6 (C16_con_6.2 R13_con_6.1)
Y_7_7: PCB_DYBoard_Collector_V1_Sh2 (U11.4), Acq_1/con_7 (C16_con_7.2 R13_con_7.1)
Y_7_8: PCB_DYBoard_Collector_V1_Sh2 (U4.4), Acq_1/con_8 (C16_con_8.2 R13_con_8.1)